# Altium schematic sheet Current Voltage Dividers.SchDoc: 3 Phase Current Voltage Dividers
size 292 x 193 mm; SheetNumber: 11; SheetTotal: 12
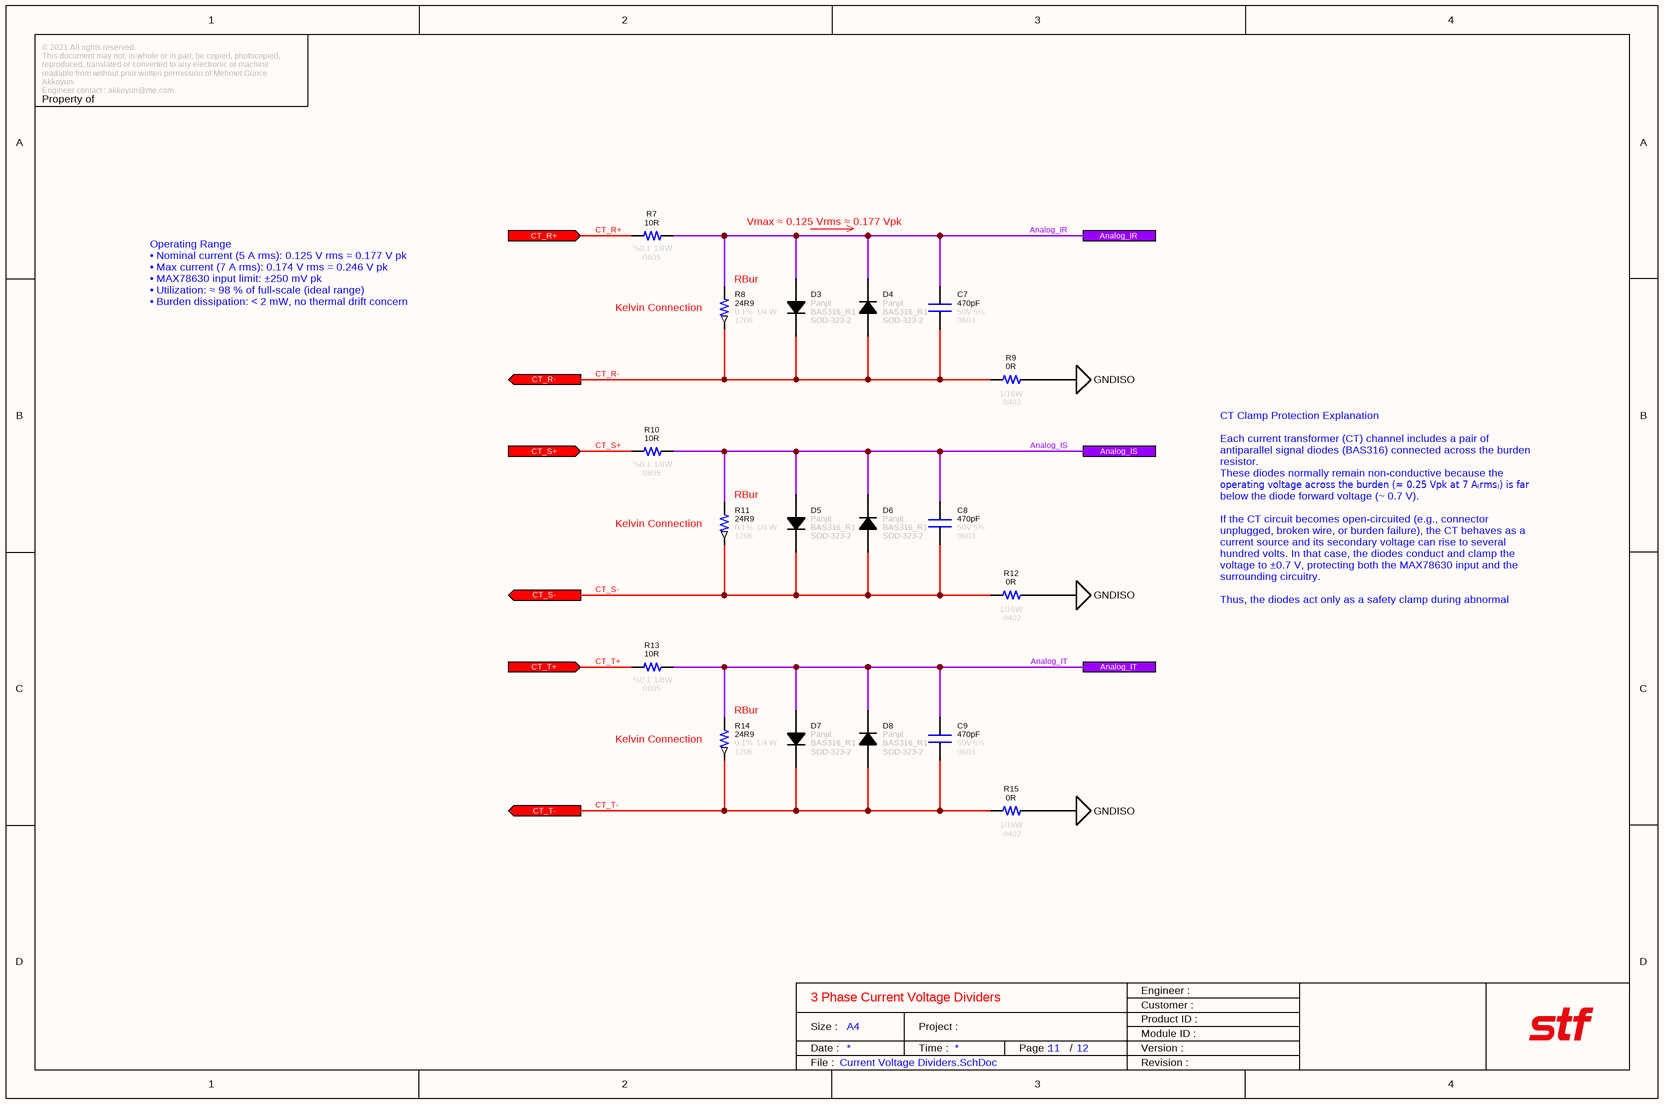
[diagram p0: Current Voltage Dividers.SchDoc]

## Parts
C7  value 470pF  Tolerance: 5%  Case: 0603  Voltage: 50V  [CAPACITOR_0603]  (hidden comment: Capacitor - 470pF [0603] (MLCC))
C8  value 470pF  Tolerance: 5%  Case: 0603  Voltage: 50V  [CAPACITOR_0603]  (hidden comment: Capacitor - 470pF [0603] (MLCC))
C9  value 470pF  Tolerance: 5%  Case: 0603  Voltage: 50V  [CAPACITOR_0603]  (hidden comment: Capacitor - 470pF [0603] (MLCC))
D3  Manufacturer Name: Panjit  Manufacturer Part Number: BAS316_R1  [SOD-323-2]  (hidden comment: BAS316_R1_00001)
D4  Manufacturer Name: Panjit  Manufacturer Part Number: BAS316_R1  [SOD-323-2]  (hidden comment: BAS316_R1_00001)
D5  Manufacturer Name: Panjit  Manufacturer Part Number: BAS316_R1  [SOD-323-2]  (hidden comment: BAS316_R1_00001)
D6  Manufacturer Name: Panjit  Manufacturer Part Number: BAS316_R1  [SOD-323-2]  (hidden comment: BAS316_R1_00001)
D7  Manufacturer Name: Panjit  Manufacturer Part Number: BAS316_R1  [SOD-323-2]  (hidden comment: BAS316_R1_00001)
D8  Manufacturer Name: Panjit  Manufacturer Part Number: BAS316_R1  [SOD-323-2]  (hidden comment: BAS316_R1_00001)
R7  value 10R  Tolerance: %0.1  Case: 0805  Power: 1/8W  [RESISTOR_0805]  (hidden comment: 10R - 0805 - %0.1 - 1/8W)
R8  value 24R9  Tolerance: 0.1%  Power: 1/4 W  Case: 1206  [RESISTOR_1206]  (hidden comment: 24R9 - 1206 - %0.1 - 1/4W)
R9  value 0R  Case: 0402  Power: 1/16W  [RESISTOR_0402]  (hidden comment: 0R - 0402 - %1 - 1/16W)
R10  value 10R  Tolerance: %0.1  Case: 0805  Power: 1/8W  [RESISTOR_0805]  (hidden comment: 10R - 0805 - %0.1 - 1/8W)
R11  value 24R9  Tolerance: 0.1%  Power: 1/4 W  Case: 1206  [RESISTOR_1206]  (hidden comment: 24R9 - 1206 - %0.1 - 1/4W)
R12  value 0R  Case: 0402  Power: 1/16W  [RESISTOR_0402]  (hidden comment: 0R - 0402 - %1 - 1/16W)
R13  value 10R  Tolerance: %0.1  Case: 0805  Power: 1/8W  [RESISTOR_0805]  (hidden comment: 10R - 0805 - %0.1 - 1/8W)
R14  value 24R9  Tolerance: 0.1%  Power: 1/4 W  Case: 1206  [RESISTOR_1206]  (hidden comment: 24R9 - 1206 - %0.1 - 1/4W)
R15  value 0R  Case: 0402  Power: 1/16W  [RESISTOR_0402]  (hidden comment: 0R - 0402 - %1 - 1/16W)

## Ports
Analog_IR, Analog_IS, Analog_IT, CT_R+ (in), CT_R- (out), CT_S+ (in), CT_S- (out), CT_T+ (in), CT_T- (out)

## Nets
GNDISO: R9.1 R12.1 R15.1
Analog_IR: C7.2 D3.2(Anode) D4.1(Cathode) R7.1 R8.2 ; port Analog_IR
Analog_IS: C8.2 D5.2(Anode) D6.1(Cathode) R10.1 R11.2 ; port Analog_IS
Analog_IT: C9.2 D7.2(Anode) D8.1(Cathode) R13.1 R14.2 ; port Analog_IT
CT_R+: R7.2 ; port CT_R+
CT_R-: C7.1 D3.1(Cathode) D4.2(Anode) R8.1 R9.2 ; port CT_R-
CT_S+: R10.2 ; port CT_S+
CT_S-: C8.1 D5.1(Cathode) D6.2(Anode) R11.1 R12.2 ; port CT_S-
CT_T+: R13.2 ; port CT_T+
CT_T-: C9.1 D7.1(Cathode) D8.2(Anode) R14.1 R15.2 ; port CT_T-

## Notes on the sheet
- Vmax ≈ 0.125 Vrms ≈ 0.177 Vpk
- Operating Range
  • Nominal current (5 A rms): 0.125 V rms = 0.177 V pk
  • Max current (7 A rms): 0.174 V rms = 0.246 V pk
  • MAX78630 input limit: ±250 mV pk
  • Utilization: ≈ 98 % of full-scale (ideal range)
  • Burden dissipation: < 2 mW, no thermal drift concern
- (near R8) Kelvin Connection
- (near R8) RBur
- (near R11) Kelvin Connection
- (near R11) RBur
- CT Clamp Protection Explanation
  Each current transformer (CT) channel includes a pair of antiparallel signal diodes (BAS316) connected across the burden resistor.
  These diodes normally remain non-conductive because the operating voltage across the burden (≈ 0.25 Vpk at 7 A₍rms₎) is far below the diode forward voltage (~ 0.7 V).
  If the CT circuit becomes open-circuited (e.g., connector unplugged, broken wire, or burden failure), the CT behaves as a current source and its secondary voltage can rise to several hundred volts. In that case, the diodes conduct and clamp the voltage to ±0.7 V, protecting both the MAX78630 input and the surrounding circuitry.
  Thus, the diodes act only as a safety clamp during abnormal conditions, without affecting normal measurement accuracy or phase angle.
- (near R14) Kelvin Connection
- (near R14) RBur
- © 2021 All rights reserved.
  This document may not, in whole or in part, be copied, photocopied, reproduced, translated or converted to any electronic or machine readable from without prior written permission of Mehmet Günce Akkoyun.
  Engineer contact : akkoyun@me.com
- Property of
- Engineer :
- Date :
- Size :
- A4
- Time :
- Project :
- Page :
- /
- Customer :
- Product ID :
- Module ID :
- Version :
- File :
- Revision :

## Library data of the parts
C7-C9 = Capacitor - 470 pF [0603-50V]: Capacitor (MLCC) - 470pF / 50V / 0603; Manufacturer Name: Murata; Manufacturer Part Number: GRM1885C1H471JA01; Subcategory: Capacitors
D3-D8 = Diode - BAS316_R1_00001: Small Signal Switching Diodes 100V,Small Signal Switching Diodes,SOD-323,4A; Forward Voltage: 150 mV; Forward Current: 4 A; Maximum Operating Temperature: + 150 C; Minimum Operating Temperature: - 55 C; Product Type: Small Signal Switching Diodes; RoHS: Yes; Case: SOD-323-2
R7 R10 R13 = Resistor - 10R [0805]: Thick Film Resistors - SMD 1/8 W 10 Ohm 0.1%; Manufacturer Name: Yageo; Manufacturer Part Number: RT0805BRD0710RL
R8 R11 R14 = Resistor - 24R9 [1206]: Burden Resistors - SMD 1/4 W 24.9 Ohm 0.1%; Manufacturer Part Number: RT1206BRD0724R9L; Manufacturer Name: Yageo
R9 R12 R15 = Resistor - 0R [0402]: Thick Film Resistors - SMD 1/16 W 0 Ohm; Manufacturer Name: Vishay; Manufacturer Part Number: CRCW04020000Z0ED; ComponentLink1Description: DataSheet; ComponentLink1URL: https://www.mouser.com.tr/datasheet/2/427/dcrcwe3-1762152.pdf; ComponentLink2Description: Mouser; ComponentLink2URL: https://www.mouser.com.tr/ProductDetail/Vishay-Dale/CRCW04020000Z0ED?qs=sGAEpiMZZMu61qfTUdNhG2DpbjADlD3GG34cJb50zyg%3D